# EAGLE design KD055HDFIA001-C001A- 5.5 Inch MIPI (Radxa CM5 Driver Board) (EAGLE 9.6.1)

## Sheet 1 of 3: TPS61160ADVRT
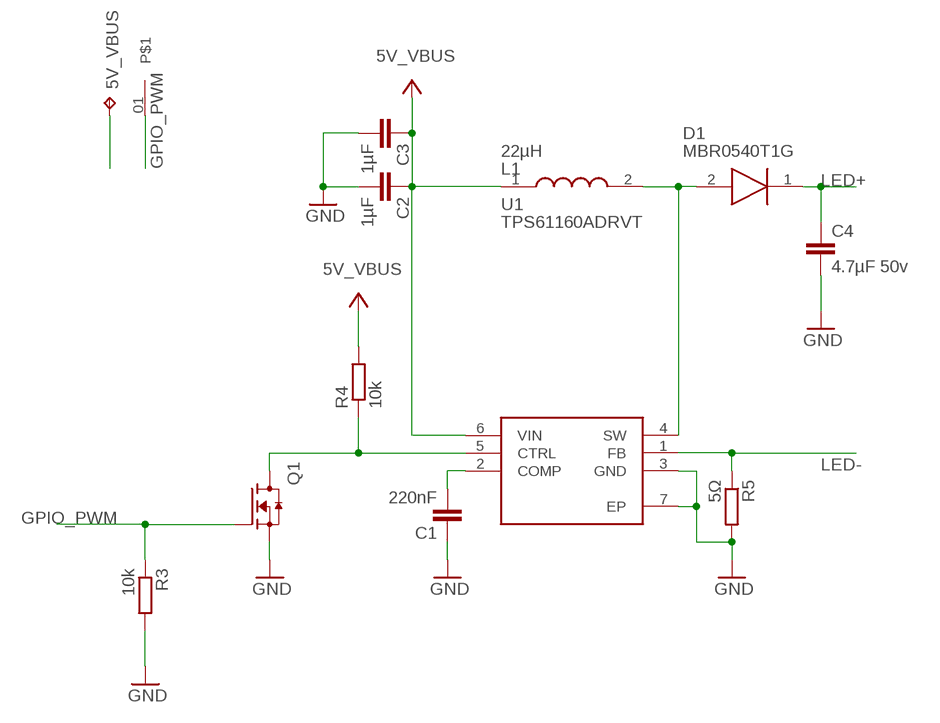
[diagram p0: schematic, sheet 1]

### Parts
5V_VBUS  TPTP19R  [TP19R]
C1  220nF  C-EUC0603  [C0603]
C2  1µF  C-EUC0603  [C0603]
C3  1µF  C-EUC0603  [C0603]
C4  4.7µF 50v  C-EUC0805  [C0805]
D1  MBR0540T1G  [SOD3716X135N]
L1  22µH  VLCF4020T-220MR56  [VLCF4020_1]
Q1  AO3400A  [SOT95P280X125-3N]
R3  10k  R-EU_R0603  [R0603]
R4  10k  R-EU_R0603  [R0603]
R5  5Ω  R-EU_R0603  [R0603]
U1  TPS61160ADRVT  [SON65P200X200X80-7N]
U$1  PAD  [AMPHENOL_10129381-908001BLF]

### Nets
5V_VBUS: 5V_VBUS.TP C2.1 C3.1 L1.1 R4.2 U1.6(VIN) ; supply symbol labelled +5V ; also sheet 3
GND: C1.1 C2.2 C3.2 C4.2 Q1.2(S) R3.2 R5.2 U1.3(GND) U1.7(EP) ; also sheet 2,3
GPIO_PWM: Q1.1(G) R3.1 U$1.01
LED+: C4.1 D1.1(K) ; also sheet 2
LED-: R5.1 U1.1(FB) ; also sheet 2
N$1: C1.2 U1.2(COMP)
N$2: D1.2(A) L1.2 U1.4(SW)
N$43: Q1.3(D) R4.1 U1.5(CTRL)

## Sheet 2 of 3: Connectors
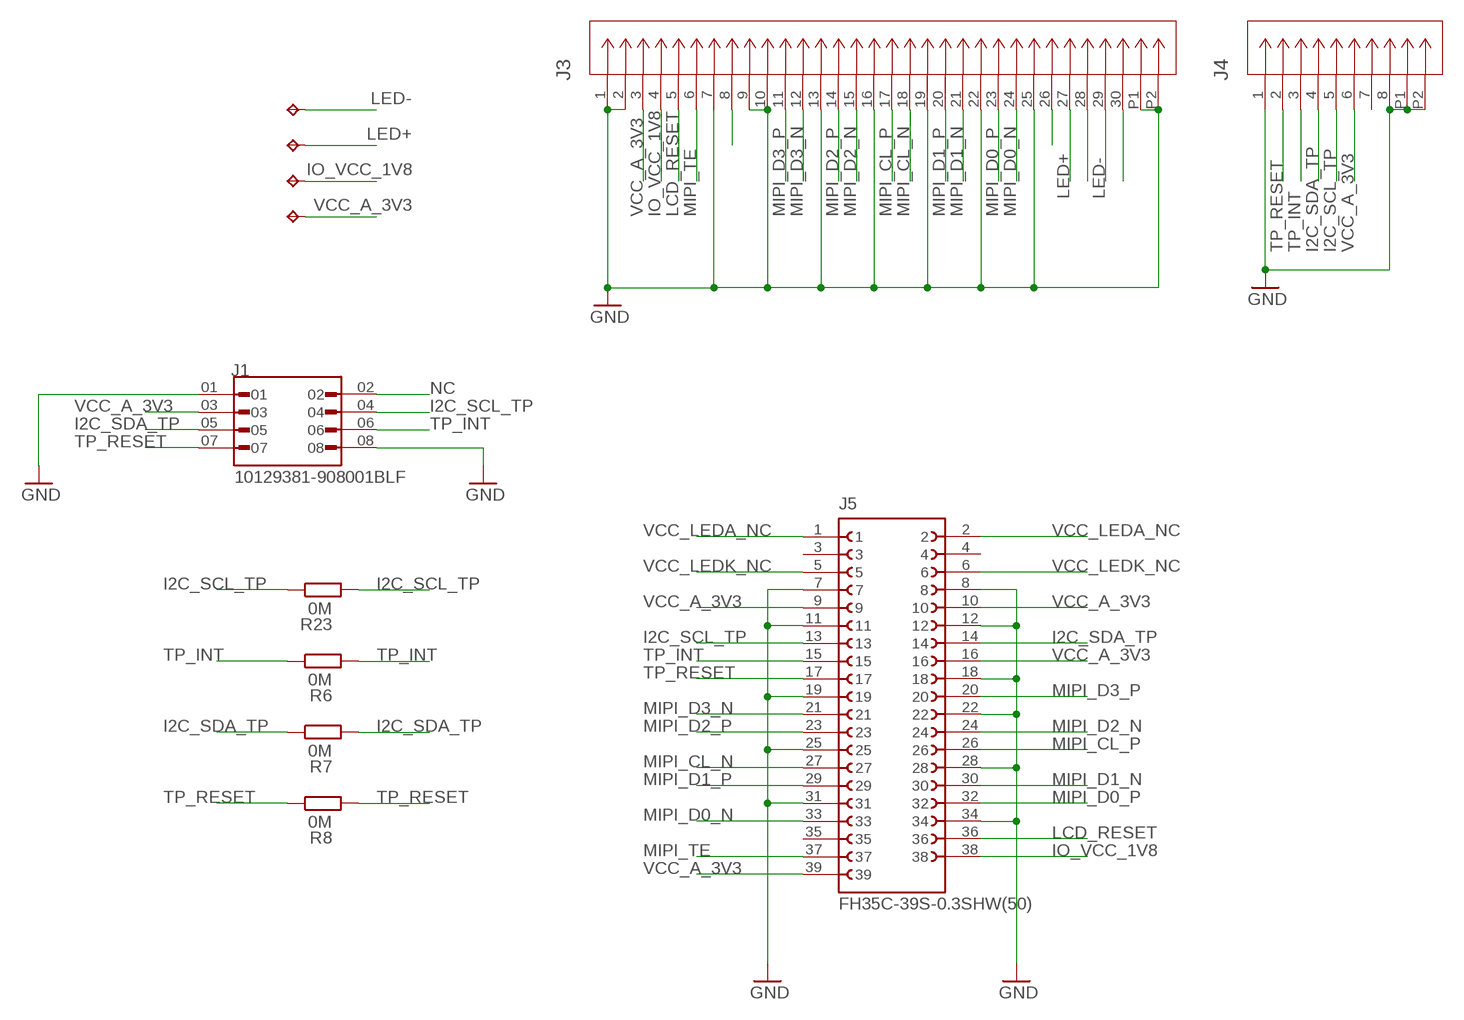
[diagram p1: schematic, sheet 2]

### Parts
IO_VCC_1V8  TPTP19R  [TP19R]
J1  10129381-908001BLF  [AMPHENOL_10129381-908001BLF]
J3  5051103091  [CON_5051103091_MOL]
J4  5051100892  [CON_5051100892_MOL]
J5  FH35C-39S-0.3SHW(50)  [HRS_FH35C-39S-0.3SHW(50)]
LED+  TPTP19R  [TP19R]
LED-  TPTP19R  [TP19R]
R6  0M  R-EU_R0402  [R0402]
R7  0M  R-EU_R0402  [R0402]
R8  0M  R-EU_R0402  [R0402]
R23  0M  R-EU_R0402  [R0402]
VCC_A_3V3  TPTP19R  [TP19R]

### Nets
GND: J1.01 J1.08 J3.1 J3.2 J3.7 J3.9 J3.10 J3.13 J3.16 J3.19 J3.22 J3.25 J3.P1 J3.P2 J4.1 J4.8 J4.P1 J4.P2 J5.7 J5.8 J5.11 J5.12 J5.18 J5.19 J5.22 J5.25 J5.28 J5.31 J5.34 ; also sheet 1,3
I2C_SCL_TP: J1.04 J4.5 J5.13 R23.1 R23.2
I2C_SDA_TP: J1.05 J4.4 J5.14 R7.1 R7.2
IO_VCC_1V8: IO_VCC_1V8.TP J3.4 J5.38
LCD_RESET: J3.5 J5.36
LED+: J3.27 LED+.TP ; also sheet 1
LED-: J3.29 LED-.TP ; also sheet 1
MIPI_CL_N [MIPI 100 Ohm]: J3.18 J5.27
MIPI_CL_P [MIPI 100 Ohm]: J3.17 J5.26
MIPI_D0_N [MIPI 100 Ohm]: J3.24 J5.33
MIPI_D0_P [MIPI 100 Ohm]: J3.23 J5.32
MIPI_D1_N [MIPI 100 Ohm]: J3.21 J5.30
MIPI_D1_P [MIPI 100 Ohm]: J3.20 J5.29
MIPI_D2_N [MIPI 100 Ohm]: J3.15 J5.24
MIPI_D2_P [MIPI 100 Ohm]: J3.14 J5.23
MIPI_D3_N [MIPI 100 Ohm]: J3.12 J5.21
MIPI_D3_P [MIPI 100 Ohm]: J3.11 J5.20
MIPI_TE: J3.6 J5.37
N$4: J3.8
N$23: J3.26
N$25: J3.28
N$27: J3.30
NC: J1.02
TP_INT: J1.06 J4.3 J5.15 R6.1 R6.2
TP_RESET: J1.07 J4.2 J5.17 R8.1 R8.2
VCC_A_3V3: J1.03 J3.3 J4.6 J5.9 J5.10 J5.16 J5.39 VCC_A_3V3.TP
VCC_LEDA_NC: J5.1 J5.2
VCC_LEDK_NC: J5.5 J5.6
Unconnected: J4.7 J5.3 J5.4 J5.35

## Sheet 3 of 3: USB-C Port
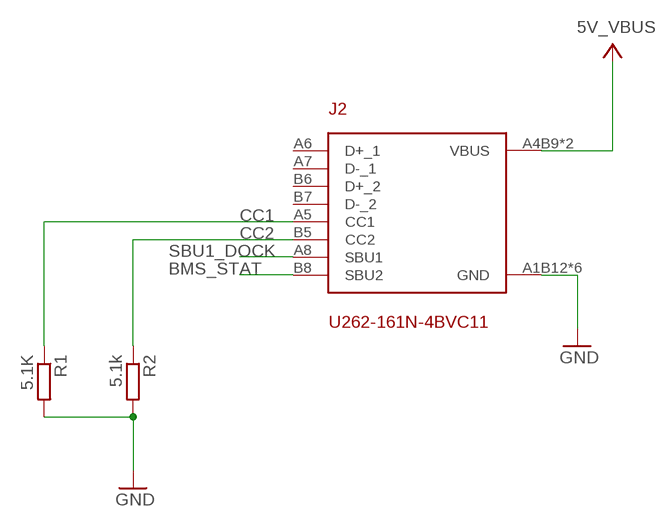
[diagram p2: schematic, sheet 3]

### Parts
J2  U262-161N-4BVC11  [U262-161N-4BVC11]
R1  5.1K  R-EU_R0603  [R0603]
R2  5.1k  R-EU_R0603  [R0603]

### Nets
5V_VBUS: J2.A4B9(VBUS) J2.B4A9(VBUS) ; supply symbol labelled VCC ; also sheet 1
BMS_STAT: J2.B8(SBU2)
CC1: J2.A5(CC1) R1.1
CC2: J2.B5(CC2) R2.1
GND: J2.A1B12(GND) J2.B1A12(GND) J2.SHIELD_1(GND) J2.SHIELD_2(GND) J2.SHIELD_3(GND) J2.SHIELD_4(GND) R1.2 R2.2 ; also sheet 1,2
SBU1_DOCK: J2.A8(SBU1)
Unconnected: J2.A6(D+_1) J2.A7(D-_1) J2.B6(D+_2) J2.B7(D-_2)

## Library data of the parts
5V_VBUS IO_VCC_1V8 LED+ LED- VCC_A_3V3 = testpad:TP: Test pad
C1-C4 = resistor:C-EU: CAPACITOR, European symbol
D1 = samacsys:MBR0540T1G: 0.5A 40V Schottky Rectifier, MBR0540T1G ON Semiconductor MBR0540T1G Schottky Diode, 0.5A, 40V, 2-Pin SOD-123 Source: Datasheet <http://www.onsemi.com/pub/Collateral/MBR0540T1-D.PDF>; ALLIED_NUMBER: 70099497; ALLIED_PRICE-STOCK: http://www.alliedelec.com/on-semiconductor-mbr0540t1g/70099497/; DESCRIPTION: 0.5A 40V Schottky Rectifier, MBR0540T1G ON Semiconductor MBR0540T1G Schottky Diode, 0.5A, 40V, 2-Pin SOD-123; HEIGHT: 1.35mm; MANUFACTURER_NAME: ON Semiconductor; MANUFACTURER_PART_NUMBER: MBR0540T1G; MOUSER_PART_NUMBER: 863-MBR0540T1G; MOUSER_PRICE-STOCK: https://www.mouser.com/Search/Refine.aspx?Keyword=863-MBR0540T1G; RS_PART_NUMBER: 0463842P; RS_PRICE-STOCK: http://uk.rs-online.com/web/p/products/0463842P
J1 = 10129381-908001BLF:10129381-908001BLF; MANUFACTURER: Amphenol ICC; PARTREV: D; STANDARD: Manufacturer Recommendations
J2 = gustl_U262-161N-4BVC11:U262-161N-4BVC11
J3 = 5051103091:5051103091; COPYRIGHT: Copyright (C) 2023 Ultra Librarian. All rights reserved.; MANUFACTURER_PART_NUMBER: 5051103091; MFR_NAME: Molex Connector Corporation
J4 = 5051100892:5051100892; COPYRIGHT: Copyright (C) 2023 Ultra Librarian. All rights reserved.; MANUFACTURER_PART_NUMBER: 5051100892; MFR_NAME: Molex Connector Corporation
J5 = FH35C-39S-0.3SHW_50_:FH35C-39S-0.3SHW(50): Check availability <https://pricing.snapeda.com/parts/FH35C-39S-0.3SHW%2850%29/Hirose%20Electric/view-part?ref=eda>; AVAILABILITY: In Stock; CHECK_PRICES: https://www.snapeda.com/parts/FH35C-39S-0.3SHW(50)/Hirose/view-part/?ref=eda; DESCRIPTION: 39 Position FPC Connector Contacts, Top and Bottom 0.012 (0.30mm) Surface Mount, Right Angle; MF: Hirose Electric; MP: FH35C-39S-0.3SHW(50); PACKAGE: None; PRICE: None; PURCHASE-URL: https://www.snapeda.com/api/url_track_click_mouser/?unipart_id=561020&manufacturer=Hirose Electric&part_name=FH35C-39S-0.3SHW(50)&search_term=fh35c-39s-0.3shw(50); SNAPEDA_LINK: https://www.snapeda.com/parts/FH35C-39S-0.3SHW(50)/Hirose/view-part/?ref=snap
L1 = samacsys:VLCF4020T-220MR56: TDK VLCF4020 Series Shielded Wire-wound SMD Inductor 22 uH +/-20% 800mA Idc Source: Datasheet <https://product.tdk.com/info/en/catalog/datasheets/inductor_commercial_power_vlcf4020_en.pdf>; DESCRIPTION: TDK VLCF4020 Series Shielded Wire-wound SMD Inductor 22 uH +/-20% 800mA Idc; HEIGHT: mm; MANUFACTURER_NAME: TDK; MANUFACTURER_PART_NUMBER: VLCF4020T-220MR56; MOUSER_PART_NUMBER: 810-VLCF4020T220MR56; MOUSER_PRICE-STOCK: https://www.mouser.com/Search/Refine.aspx?Keyword=810-VLCF4020T220MR56; RS_PART_NUMBER: 6442781; RS_PRICE-STOCK: https://uk.rs-online.com/web/p/products/6442781
Q1 = AO3400A:AO3400A: Trans MOSFET N-CH 30V 5.7A 3-Pin SOT-23; DESCRIPTION: N-Channel 30V 5.7A (Ta) 1.4W (Ta) Surface Mount SOT-23-3L; DIGI-KEY_PART_NUMBER: 785-1000-1-ND; MF: Alpha &; MP: AO3400A; PACKAGE: SOT-23 Alpha &amp; Omega Semiconductor
R1-R8 R23 = rcl:R-EU_: RESISTOR, European symbol; SPICEPREFIX: R
U1 = samacsys:TPS61160ADRVT: White LED Driver with PWM Brightness Control in 2mm x 2mm Package. Up to 10 LEDs in Series Source: Datasheet <http://www.ti.com/lit/ds/symlink/tps61160a.pdf>; DESCRIPTION: White LED Driver with PWM Brightness Control in 2mm x 2mm Package. Up to 10 LEDs in Series; HEIGHT: 0.8mm; MANUFACTURER_NAME: Texas Instruments; MANUFACTURER_PART_NUMBER: TPS61160ADRVT; MOUSER_PART_NUMBER: 595-TPS61160ADRVT; MOUSER_PRICE-STOCK: https://www.mouser.com/Search/Refine.aspx?Keyword=595-TPS61160ADRVT; RS_PART_NUMBER: 7099044P; RS_PRICE-STOCK: http://uk.rs-online.com/web/p/products/7099044P
U$1 = PAD 2.54:PAD

## Net classes
1 USB 2.0 Differential Pair: width 0.192 mm, clearance 0.114 mm
2 MIPI 100 Ohm: width 0.124 mm, clearance 0.114 mm

## Board
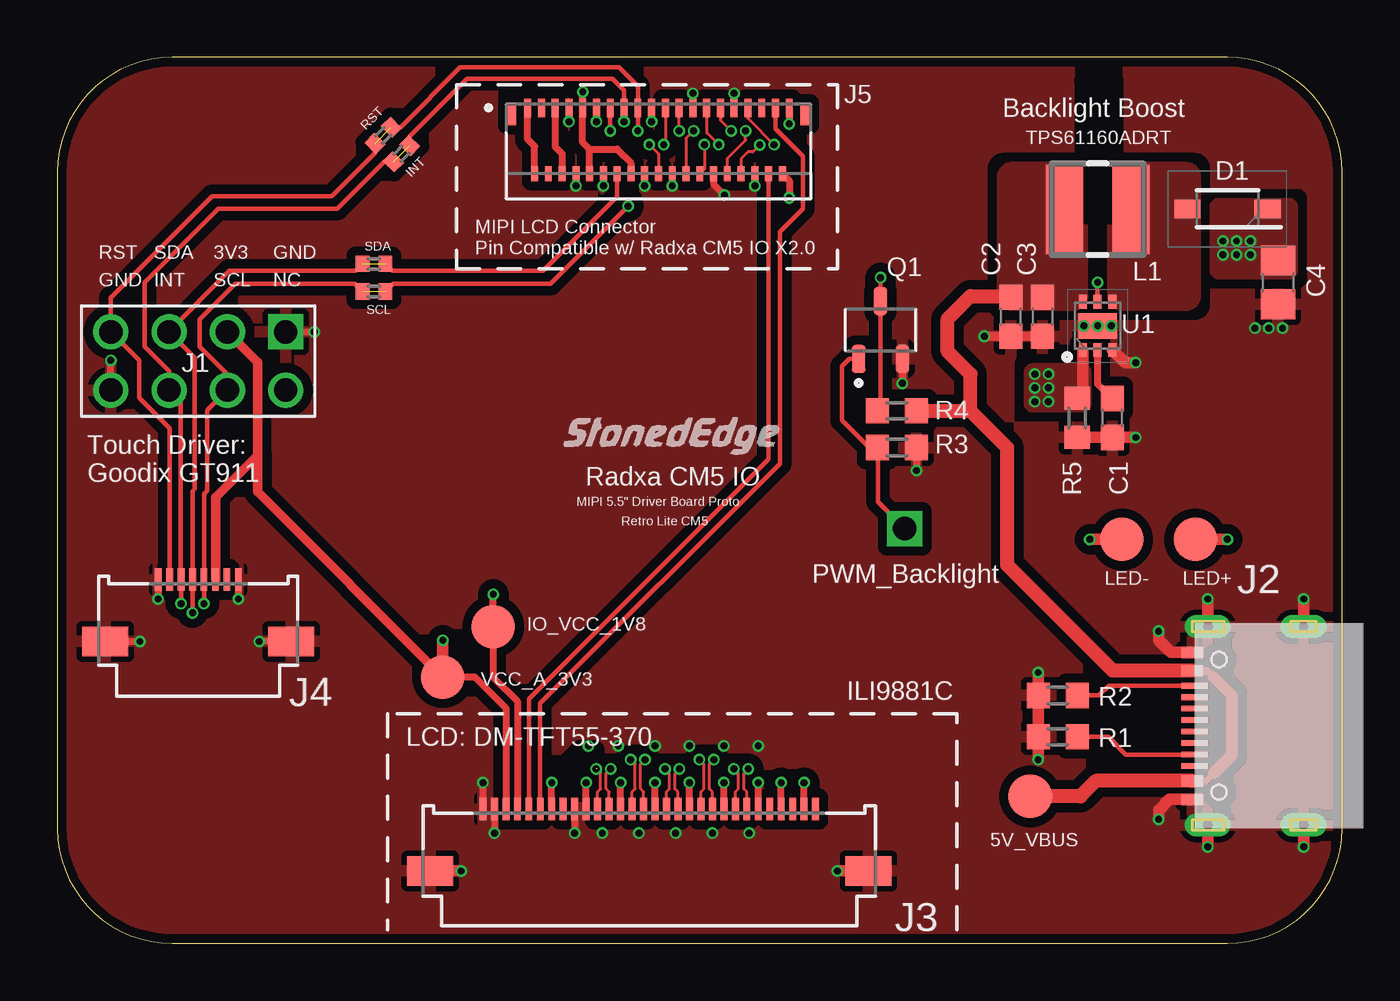
[diagram p3: board, top side]
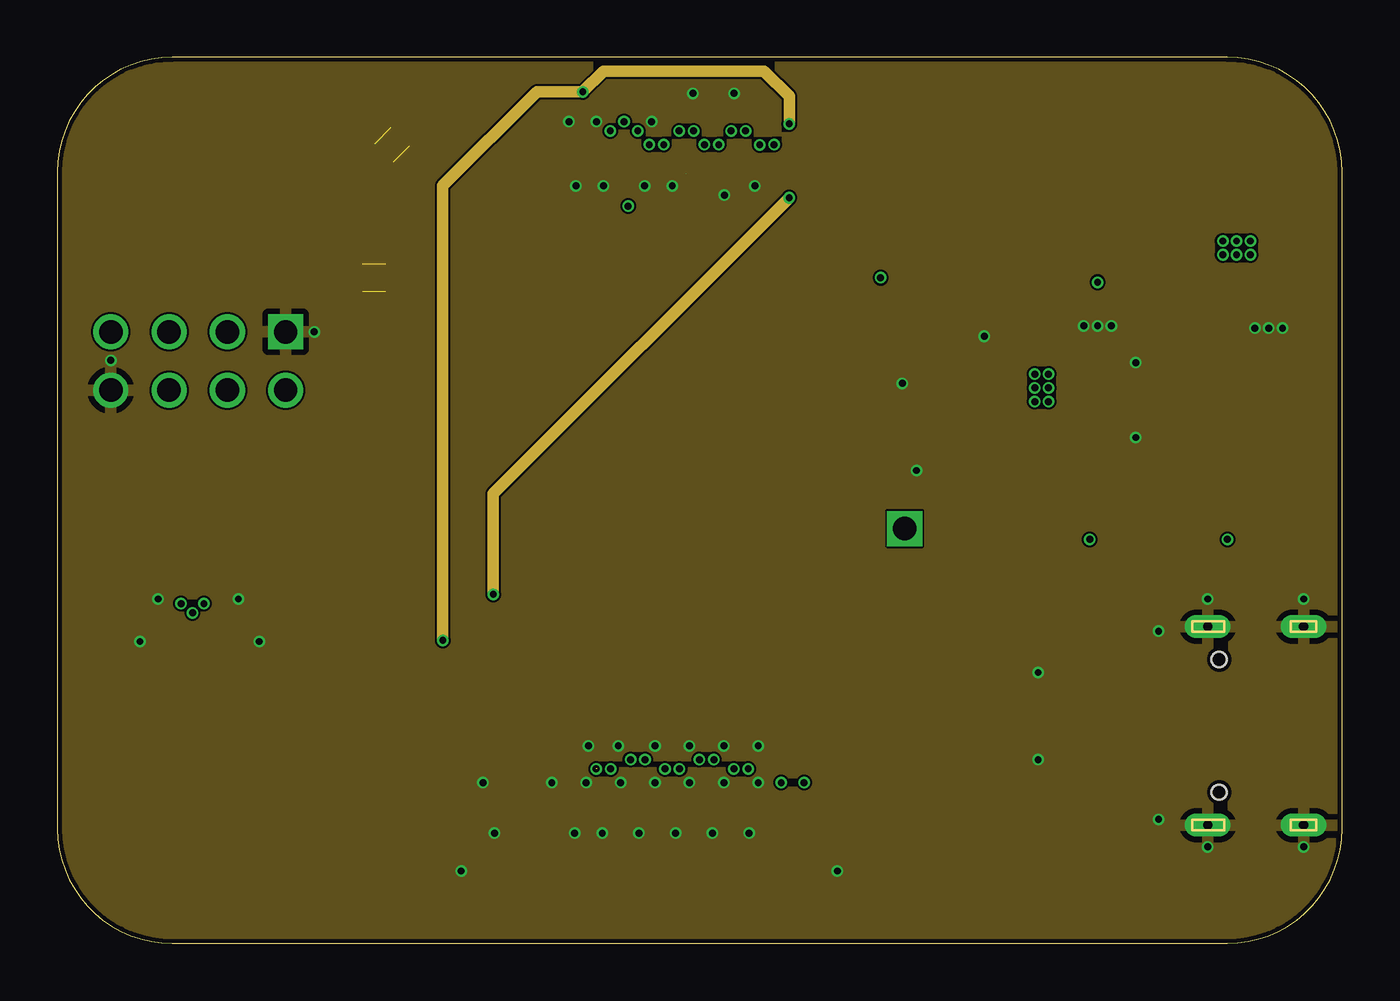
[diagram p4: board, inner layer Route2]
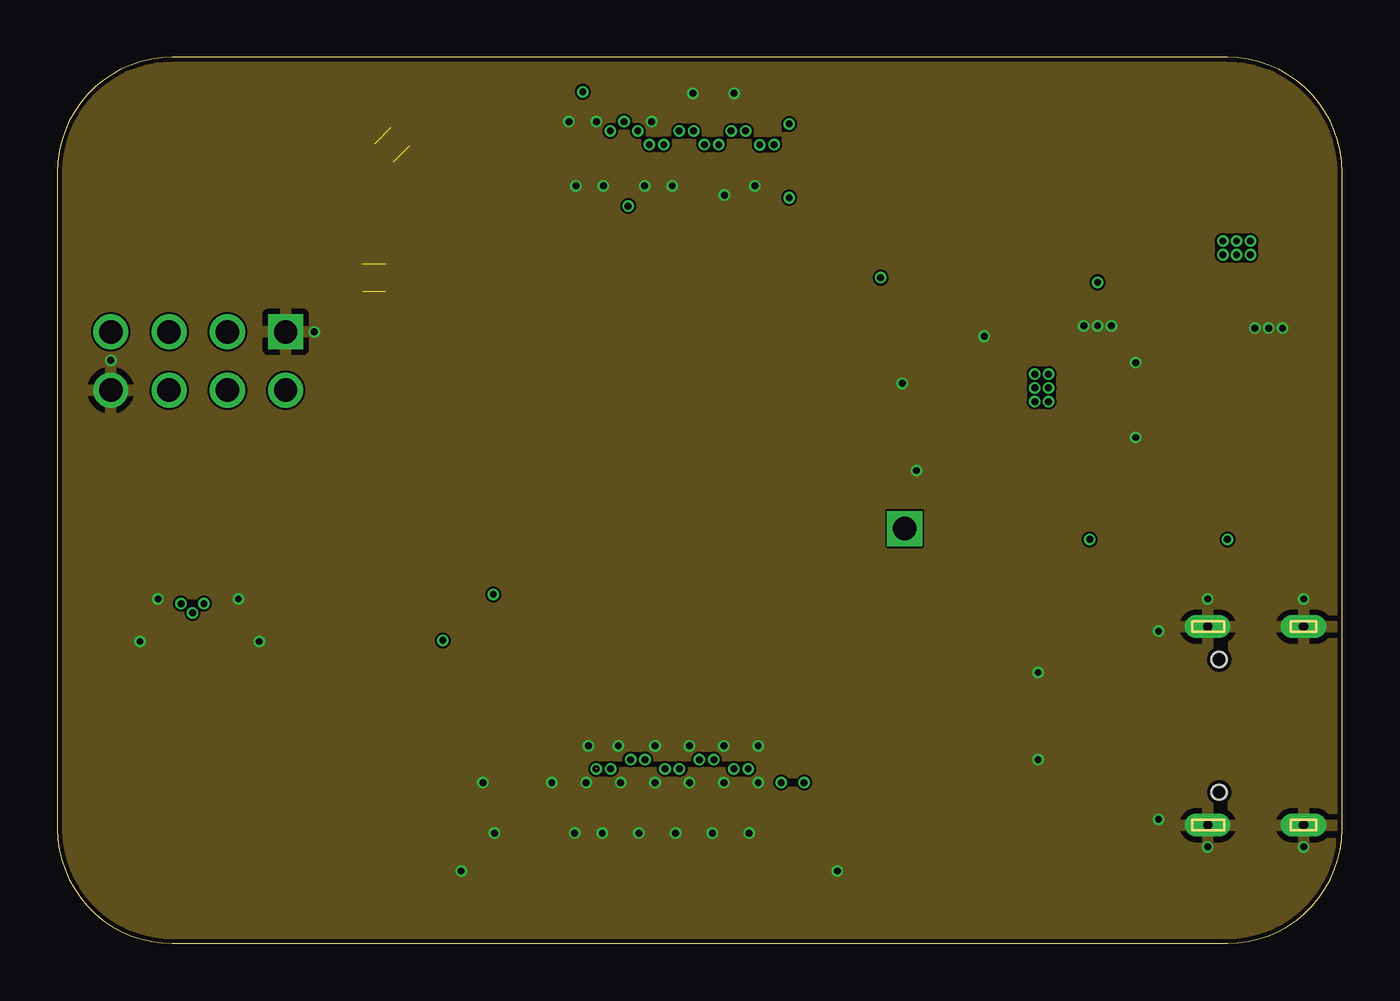
[diagram p5: board, inner layer Route15]
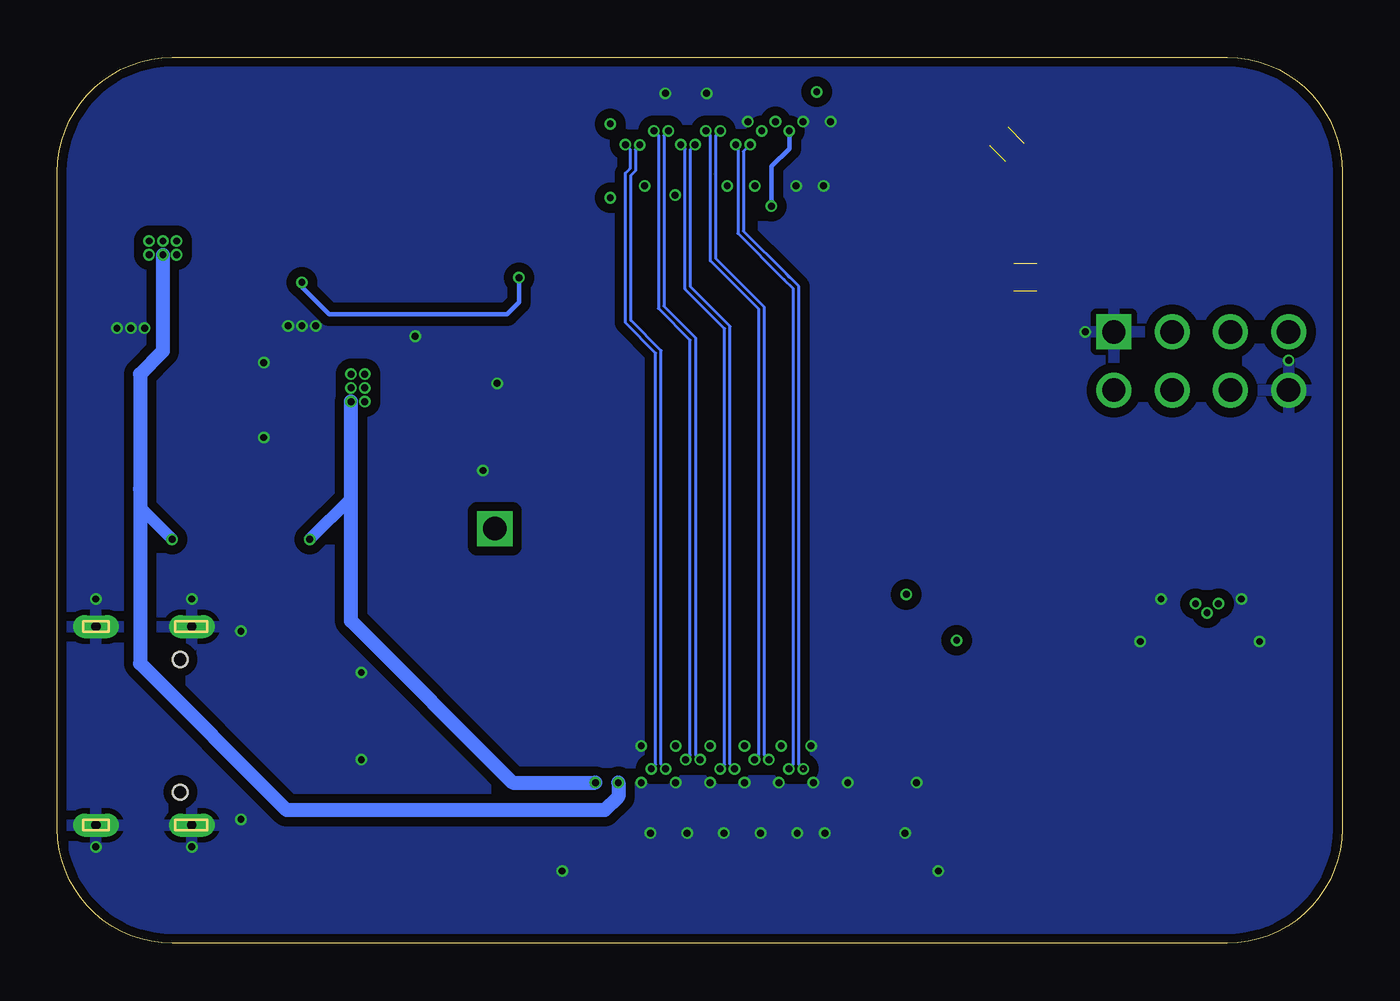
[diagram p6: board, bottom side, seen from below]

Size 56 x 38.6 mm. Coordinates in mm from the lower left corner, seen from the top.
Outline: 0,33.6 0,5 arc90 5,0 51,0 arc90 56,5 56,33.6 arc90 51,38.6 5,38.6 arc90 0,33.6
Copper layers (1+2*15+16): Top 0.035mm / dielectric 0.2104mm / Route2 0.0152mm / dielectric 1.065mm / Route15 0.0152mm / dielectric 0.2104mm / Bottom 0.035mm
Design rules "default *": minimum track width 3.5mil, minimum drill 0.2mm, track to track 3.5mil, track to pad 3.5mil, pad to pad 3.5mil, via to via 5mil, smd to smd 0mil, copper to edge 0.2mm, drill to drill 5mil, minimum pad ring 4mil, minimum via ring 4mil, stop-mask expansion 0mil, vias tented up to drill 100mil, thermal gap 10mil
tRestrict: area 44.8,31.4 to 46,37.6; area 21.6,6.6 to 23.4,8.4

### Footprints (pad centres in the part's own frame; a part is rotated, then mirrored left to right if it is on the bottom)
TP19R = smd 1.9 x 1.9: TP 0,0
C0603 = smd 1.1 x 1: 1 -0.85,0; 2 0.85,0
C0805 = smd 1.3 x 1.5: 1 -0.95,0; 2 0.95,0
SOD3716X135N = smd 1.15 x 0.8: 1 -1.75,0; 2 1.75,0
AMPHENOL_10129381-908001BLF = drill 1.02 pad 1.53 square: 01 -3.81,-1.27 | drill 1.02 pad 1.53: 02 -3.81,1.27; 03 -1.27,-1.27; 04 -1.27,1.27; 05 1.27,-1.27; 06 1.27,1.27; 07 3.81,-1.27; 08 3.81,1.27
U262-161N-4BVC11 = smd 0.5 x 0.95: A1B12 -3.2,7.455; A4B9 -2.4,7.455; B1A12 3.2,7.455; B4A9 2.4,7.455 | smd 0.25 x 1.15: A5 -1.25,7.355; A6 -0.25,7.355; A7 0.25,7.355; A8 1.25,7.355; B5 1.75,7.355; B6 0.75,7.355; B7 -0.75,7.355; B8 -1.75,7.355 | drill 0.4 pad 1 long: SHIELD_1 -4.325,6.78; SHIELD_2 -4.325,2.6; SHIELD_3 4.325,6.78; SHIELD_4 4.325,2.6 | hole 0.65: -2.89,6.28; 2.89,6.28
CON_5051103091_MOL = smd 0.3 x 1: 1 -7.25,2.45; 2 -6.75,2.45; 3 -6.25,2.45; 4 -5.75,2.45; 5 -5.25,2.45; 6 -4.75,2.45; 7 -4.25,2.45; 8 -3.75,2.45; 9 -3.25,2.45; 10 -2.75,2.45; 11 -2.25,2.45; 12 -1.75,2.45; 13 -1.25,2.45; 14 -0.75,2.45; 15 -0.25,2.45; 16 0.25,2.45; 17 0.75,2.45; 18 1.25,2.45; 19 1.75,2.45; 20 2.25,2.45; 21 2.75,2.45; 22 3.25,2.45; 23 3.75,2.45; 24 4.25,2.45; 25 4.75,2.45; 26 5.25,2.45; 27 5.75,2.45; 28 6.25,2.45; 29 6.75,2.45; 30 7.25,2.45 | smd 2 x 1.3: P1 -9.55,-0.25; P2 9.55,-0.25
CON_5051100892_MOL = smd 0.3 x 1: 1 -1.75,2.45; 2 -1.25,2.45; 3 -0.75,2.45; 4 -0.25,2.45; 5 0.25,2.45; 6 0.75,2.45; 7 1.25,2.45; 8 1.75,2.45 | smd 2 x 1.3: P1 -4.05,-0.25; P2 4.05,-0.25
HRS_FH35C-39S-0.3SHW(50) = smd 0.3 x 0.8: 1 5.7,-1.4; 3 5.1,-1.4; 5 4.5,-1.4; 7 3.9,-1.4; 9 3.3,-1.4; 11 2.7,-1.4; 13 2.1,-1.4; 15 1.5,-1.4; 17 0.9,-1.4; 19 0.3,-1.4; 21 -0.3,-1.4; 23 -0.9,-1.4; 25 -1.5,-1.4; 27 -2.1,-1.4; 29 -2.7,-1.4; 31 -3.3,-1.4; 33 -3.9,-1.4; 35 -4.5,-1.4; 37 -5.1,-1.4; 39 -5.7,-1.4 | smd 0.3 x 0.65: 2 5.4,1.475; 4 4.8,1.475; 6 4.2,1.475; 8 3.6,1.475; 10 3,1.475; 12 2.4,1.475; 14 1.8,1.475; 16 1.2,1.475; 18 0.6,1.475; 20 0,1.475; 22 -0.6,1.475; 24 -1.2,1.475; 26 -1.8,1.475; 28 -2.4,1.475; 30 -3,1.475; 32 -3.6,1.475; 34 -4.2,1.475; 36 -4.8,1.475; 38 -5.4,1.475 | smd 0.4 x 0.95: S1 6.4,-1.125; S2 -6.4,-1.125
VLCF4020_1 = smd 3.9 x 1.6: 1 0,-1.45; 2 0,1.45
SOT95P280X125-3N = smd 1.21 x 0.59: 1 -1.255,0.95; 2 -1.255,-0.95; 3 1.255,0
R0603 = smd 1 x 1.1: 1 -0.85,0; 2 0.85,0
R0402 = smd 0.6 x 0.7: 1 -0.5,0; 2 0.5,0
SON65P200X200X80-7N = smd 0.6 x 0.35: 1 -1.05,0.65; 2 -1.05,0; 3 -1.05,-0.65; 4 1.05,-0.65; 5 1.05,0; 6 1.05,0.65 | smd 1.1 x 1.7: 7 0,0
AMPHENOL_10129381-908001BLF' = drill 1.02 pad 1.53 square: 01 -3.81,-1.27

### Placement (x,y rotation side)
5V_VBUS  42.4,6.4 0 top
C1  45.98,22.89 90 top
C2  41.55,27.3 270 top
C3  42.93,27.3 270 top
C4  53.2,28.8 270 top
D1  51,32 180 top
IO_VCC_1V8  19,13.8 0 top
J1  6.14,25.37 180 top
J2  56.92,9.47 90 top
J3  25.8,3.4 0 top
J4  6.14,13.4 0 top
J5  26.2,35 180 top
L1  45.34,31.98 270 top
LED+  49.6,17.6 0 top
LED-  46.4,17.6 0 top
Q1  35.88,26.72 90 top
R1  43.6,9 180 top
R2  43.6,10.8 180 top
R3  36.6,21.6 0 top
R4  36.6,23.2 0 top
R5  44.45,22.89 270 top
R6  15,34.4 45 top
R7  13.8,29.6 0 top
R8  14.2,35.2 45 top
R23  13.8,28.4 0 top
U1  45.34,26.9 90 top
U$1  PAD  [AMPHENOL_10129381-908001BLF']  40.74,19.34 0 top
VCC_A_3V3  16.8,11.6 0 top

### Tracks (layer width: path | path; a pad name or v marks a point on that pad's centre or on a via)
5V_VBUS
  Top 0.305: J2.A4B9 50.08,7.08 50.4,7.4 | J2.B4A9 50.12,11.88 50.4,11.6
  Top 0.508: 50.4,7.4 51.2,8.2 51.2,10.8 50.4,11.6
  Top 0.61: 5V_VBUS.TP 44.6,6.4 45.27,7.08 J2.A4B9 | J2.B4A9 46,11.88 41.4,16.48 41.4,21.6 39.8,23.2 | R4.2 39.8,23.2 | 39.8,23.2 39.8,24.8 38.8,25.8 38.8,27.2 39.8,28.2 41.5,28.2 C2.1
  pour Top (no thermals): 41.63,34 44.24,34 arc-90 44.87,33.37 44.87,28.23 arc-90 44.24,27.6 41.63,27.6 arc-90 41,28.23 41,33.37 arc-90
CC1
  Top 0.203: J2.A5 46.58,8.22 45.8,9 R1.1
CC2
  Top 0.203: J2.B5 45.83,11.22 45.4,10.8 R2.1
GND  (via drill 0.3)
  Top 0.203: J5.7 v22.3,35.8 | J5.11 v23.5,35.8
  Top 0.305: J3.13 v24.55,7 | J3.16 v26.05,7 | J3.19 v27.55,7 | J3.22 v29.05,7 | J3.25 v30.55,7 | J3.10 v23.05,7 | J3.9 v22.55,4.8 | J3.7 v21.55,7 | J3.2 v19.05,4.8 | J3.1 v18.55,7 | R3.2 v37.45,20.6 | Q1.2 v36.83,24.4 | J4.P1 v3.6,13.15 | J4.P2 v8.8,13.15 | J1.01 v11.2,26.64 | J1.08 v2.33,25.4 | J4.1 v4.39,15 | J4.8 v7.89,15 | J5.25 v27.7,37.03 | J5.19 v25.9,35.8 | J5.31 v29.5,37.03 | J5.28 28.6,33.08 v29.08,32.6 | J5.22 v26.8,33 | J5.18 v25.6,33 | J5.12 v23.8,33 | J5.8 v22.6,33 | J5.34 v30.4,33
  Top 0.406: C3.2 C2.2 v40.4,26.45
  Top 0.508: R5.2 C1.1 v47,22.04 | U1.3 46.54,25.3 v47,25.3 | v42.75,8 R1.2 R2.2 v42.75,11.8 | J3.P2 v34,3.15 | J3.P1 v17.6,3.15 | J2.A1B12 48.48,6.28 48,5.8 v48,5.4 | J2.B1A12 48.52,12.68 48,13.2 v48,13.6 | J2.SHIELD_3 v50.14,15 | J2.SHIELD_4 v54.32,15 | J2.SHIELD_1 v50.14,4.2 | J2.SHIELD_2 v54.32,4.2
  other vias: 52.2,26.8 52.8,26.8 53.4,26.8 45.34,26.9 45.94,26.9 44.74,26.9 24.45,8.6 26.05,8.6 27.55,8.6 29.05,8.6 30.55,8.6 23.15,8.6 23.75,4.8 25.35,4.8 26.95,4.8 28.55,4.8 30.15,4.8
  pour Bottom (isolate 0.406, rank 2): -1,40.3 -1,-2 57.5,-2 57.5,40.3
  pour Top (isolate 0.406, rank 2): -2.5,42.2 -2.5,-3.7 59.3,-3.7 59.3,42.2
  pour Route15: -4.4,44 -4.4,-5.6 61.2,-5.6 61.2,44
  pour Route2: -6.4,46 -6.4,-7.6 63,-7.6 63,46
GPIO_PWM
  Top 0.203: Q1.1 34.53,25.46 34.2,25.14 34.2,22.8 35.4,21.6 R3.1 35.76,21.59 35.76,19.24 U$1.01
I2C_SCL_TP  (via drill 0.3)  (1 unrouted)
  Top 0.203: v6.39,14.8 J4.5 6.39,19.59 6.53,19.73 6.53,23.22 J1.04 7.41,24.79 6.2,26 6.2,27.2 7.75,28.75 12.95,28.75 R23.1 | J5.13 v24.1,35.4 | R23.2 14.63,28.73 21.49,28.73 v24.88,32.12
  Bottom 0.203: v24.1,35.4 24.1,34.62 24.87,33.85 v24.87,32.13 v24.88,32.12
I2C_SDA_TP  (via drill 0.3)  (1 unrouted)
  Top 0.203: v5.89,14.4 J4.4 5.89,19.69 5.99,19.79 5.99,25.52 J1.05 4.87,26.67 7.5,29.3 13,29.3 R7.1 | J5.14 24.4,32.53 21.16,29.3 14.6,29.3 R7.2
IO_VCC_1V8  (via drill 0.3)
  Top 0.305: J3.4 20.05,10.55 19,11.6 IO_VCC_1V8.TP v19,15.2 | J5.38 31.9,33.22 v31.9,32.48
  Route2 0.508: v31.9,32.48 19,19.58 v19,15.2
LCD_RESET
  Top 0.203: J3.5 20.55,10.65 31,21.1 J5.36
LED+  (via drill 0.3)
  Top 0.305: J3.27 v31.55,7
  Top 0.508: LED+.TP v51,17.6
  Bottom 0.508: v51,17.6 52.4,19 52.4,19.8
  Bottom 0.61: v31.55,7 31.55,6.39 32.14,5.8 46,5.8 52.4,12.2 52.4,19.8 52.4,24.8 51.4,25.8 v51.4,30
  other vias: 50.8,30 50.8,30.6 51.4,30.6 52,30 52,30.6
  pour Top (no thermals): 50.61,29 53.68,29 arc90 54,29.32 54,32.08 arc90 53.68,32.4 50.61,32.4 arc90 50.29,32.08 50.29,29.32 arc90
LED-  (via drill 0.3)
  Top 0.305: J3.29 v32.55,7
  Top 0.508: U1.1 44.69,23.98 R5.1 | LED-.TP v45,17.6
  Bottom 0.508: v45,17.6 43.2,19.4 43.2,19.6
  Bottom 0.61: v32.55,7 36.15,7 43.2,14.05 43.2,19.6 v43.2,23.6
  other vias: 42.6,23.6 42.6,24.2 43.2,24.2 43.2,24.8 42.6,24.8
  pour Top (no thermals): 42.52,25.2 44.68,25.2 arc-90 45,24.88 45,23.52 arc-90 44.68,23.2 42.52,23.2 arc-90 42.2,23.52 42.2,24.88 arc-90
MIPI_CL_N  (via drill 0.3)
  Top 0.124: J5.27 28.3,35.33 | 28.31,35.31 v28.83,34.8 | J3.18 27.05,6.6 26.92,6.73 26.92,7.4 v27.12,7.6
  Top 0.126: 28.3,35.33 28.31,35.31
  Bottom 0.124: v27.12,7.6 26.92,7.8 26.92,26.78 28.63,28.5 28.63,34.6 v28.83,34.8
MIPI_CL_P  (via drill 0.3)
  Top 0.124: J3.17 26.55,6.6 26.68,6.73 26.68,7.4 v26.48,7.6
  Top 0.126: J5.26 28.2,33.73 v28.2,34.8
  Bottom 0.124: v26.48,7.6 26.68,7.8 26.68,26.88 28.4,28.6 28.4,34.6 v28.2,34.8
MIPI_D0_N  (via drill 0.3)
  Top 0.124: J5.33 30.1,35.94 v31.24,34.8 | J3.24 30.05,6.6 29.92,6.73 29.92,7.4 v30.12,7.6
  Bottom 0.124: v31.24,34.8 31.05,34.61 31.05,34.6 31.05,33.75 31.24,33.56 31.24,28.4 31.24,27.04 29.92,25.72 29.92,7.8 v30.12,7.6
MIPI_D0_P  (via drill 0.3)
  Top 0.124: v30.61,34.79 30.31,34.49 30.11,34.49 29.8,34.17 J5.32 | J3.23 29.55,6.6 29.68,6.73 29.68,7.4 v29.48,7.6
  Bottom 0.124: v30.61,34.79 30.81,34.59 30.81,33.65 31,33.46 31,28.3 31,27.14 29.68,25.82 29.68,7.8 v29.48,7.6
MIPI_D1_N  (via drill 0.3)
  Top 0.124: J5.30 29.2,34.2 30,35 v30,35.4 | J3.21 28.55,6.6 28.42,6.73 28.42,7.8 v28.62,8
  Bottom 0.124: v28.62,8 28.42,8.2 28.42,26.28 29.8,27.67 29.8,35.2 v30,35.4
MIPI_D1_P  (via drill 0.3)
  Top 0.124: J5.29 28.9,35.87 | J3.20 28.05,6.6 28.18,6.73 28.18,7.8 v27.98,8
  Top 0.126: v29.37,35.4 28.9,35.87
  Bottom 0.124: v27.98,8 28.18,8.2 28.18,26.38 29.57,27.77 29.57,35.2 v29.37,35.4
MIPI_D2_N  (via drill 0.3)  (1 unrouted)
  Top 0.124: 27.4,35.07 27.4,33.6 | J3.15 25.55,6.6 25.42,6.73 25.42,7.8 v25.62,8 | v27.73,35.4
  Top 0.126: 27.4,33.6 J5.24 | v27.73,35.4 27.4,35.07
  Bottom 0.124: v25.62,8 25.42,8.2 25.42,27.62 27.53,29.73 27.53,35.2 v27.73,35.4
MIPI_D2_P  (via drill 0.3)
  Top 0.124: v27.1,35.4 J5.23 | J3.14 25.05,6.6 25.18,6.73 25.18,7.8 v24.98,8
  Bottom 0.124: v24.98,8 25.18,8.2 25.18,27.72 27.3,29.83 27.3,35.2 v27.1,35.4
MIPI_D3_N  (via drill 0.3)
  Top 0.124: J5.21 26.5,34.87 v26.43,34.8 | J3.12 24.05,6.6 23.92,6.73 23.92,7.4 v24.12,7.6
  Bottom 0.124: v24.12,7.6 23.92,7.8 23.92,28.52 24.32,28.92
  Bottom 0.126: 24.32,28.92 26.34,30.93 26.34,34.7 v26.43,34.8
MIPI_D3_P  (via drill 0.3)  (1 unrouted)
  Top 0.124: v25.8,34.8 26.2,34.4 J5.20 | J3.11 23.55,6.6 23.68,6.73 23.68,7.4 23.51,7.57 23.51,7.6
  Bottom 0.124: v23.48,7.6 23.68,7.8 23.68,28.62 24.23,29.17
  Bottom 0.126: v25.8,34.8 26.09,34.51 26.09,31.04 24.23,29.17 24.08,29.02
MIPI_TE
  Top 0.203: J3.6 21.05,10.45 31.5,20.9 31.5,31 32.5,32 32.5,34.3 31.3,35.5 J5.37
N$1
  Top 0.305: U1.2 45.34,24.38 C1.2
N$2
  pour Top (no thermals): 49.8,28.23 49.8,33.37 arc90 49.16,34 46.44,34 arc90 45.8,33.37 45.8,28.23 arc90 46.44,27.6 49.16,27.6 arc90
N$43  (via drill 0.3)
  Top 0.203: U1.5 v45.34,28.8 | R4.1 35.88,23.33 Q1.3 v35.88,29
  Bottom 0.203: v45.34,28.8 45.34,28.58 44.16,27.4 36.4,27.4 35.88,27.92 v35.88,29
TP_INT  (via drill 0.3)  (1 unrouted)
  Top 0.203: v5.39,14.8 J4.3 5.38,23.59 J1.06 4.87,24.93 3.8,26 3.8,28.8 7,32 12.2,32 14.25,34.05 R6.1 | v24.7,35.8 J5.15 24.7,37.16 24.2,37.66 17.86,37.66 15.35,35.15 R6.2
TP_RESET  (via drill 0.3)  (1 unrouted)
  Top 0.203: J4.2 4.89,22.45 3.57,23.77 3.57,25.4 J1.07 2.33,28.13 6.76,32.56 11.96,32.56 13.85,34.45 R8.1 | v25.3,35.4 J5.17 25.3,37.34 24.47,38.16 17.56,38.16 14.95,35.55 R8.2
VCC_A_3V3  (via drill 0.3)
  Top 0.305: J3.3 19.55,10.25 18.2,11.6 VCC_A_3V3.TP | J5.10 23.2,34.6 | 23.2,34.6 22.9,34.9 J5.9 v22.9,37.1 | J5.16 25,34 24.4,34.6 23.2,34.6 | J5.39 v31.9,35.7 | 8.73,25.32
  Top 0.406: 8.73,25.32 J1.03 | J4.6 6.89,19.42 8.73,21.27 | 8.73,21.27 8.73,25.32 | 8.73,21.27 8.73,19.67 VCC_A_3V3.TP
  Top 0.508: VCC_A_3V3.TP v16.8,13.2
  Route2 0.508: v16.8,13.2 16.8,33 20.9,37.1 v22.9,37.1 23.8,38 30.8,38 31.9,36.9 v31.9,35.7
VCC_LEDA_NC
  Top 0.305: J5.2 20.8,34.73 20.5,35.02 J5.1
VCC_LEDK_NC
  Top 0.305: J5.5 21.7,34.7 22,34.4 J5.6

### Text on the board
tPlace: Backlight Boost | RST | TPS61160ADRT | INT | RST | SDA | 3V3 | GND | SDA | MIPI LCD Connector / Pin Compatible w/ Radxa CM5 IO X2.0 | GND | INT | SCL | NC | SCL | Touch Driver: / Goodix GT911 | PWM_Backlight | J4 | ILI9881C | LCD: DM-TFT55-370 | J3
tNames: Radxa CM5 IO | MIPI 5.5" Driver Board Proto | Retro Lite CM5